# Altium schematic sheet Schematic_photodiode_1.SchDoc
size A3; SheetNumber: 1; SheetTotal: 1
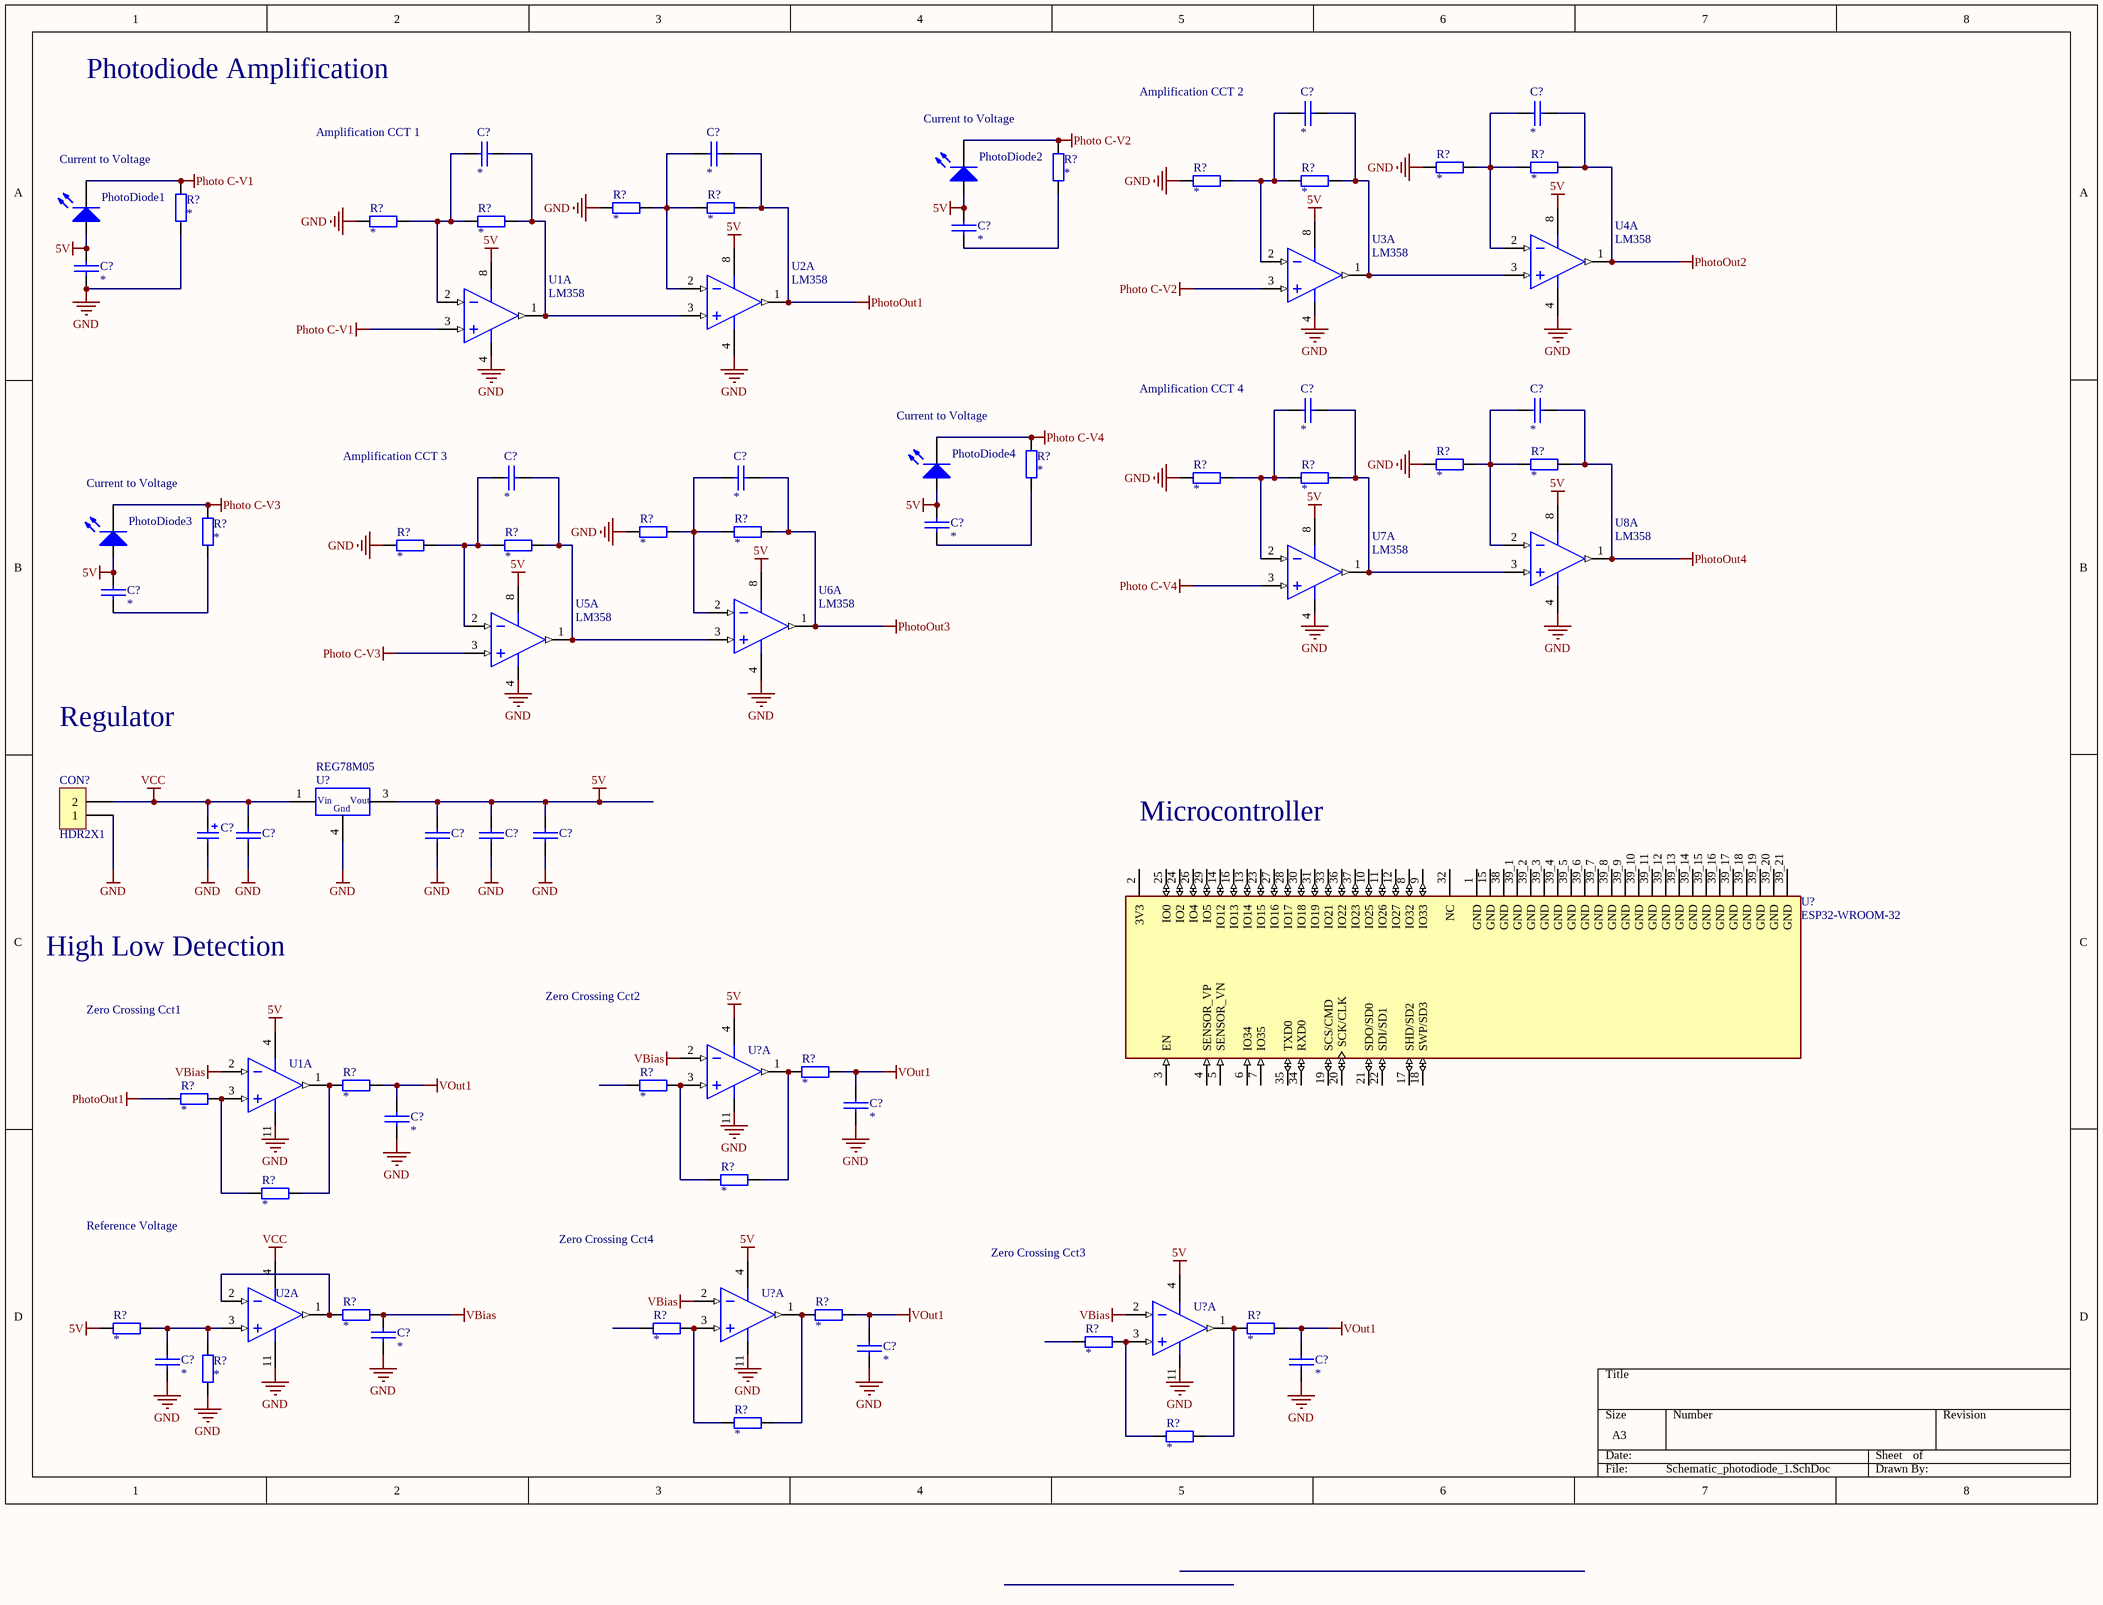
[diagram p0: Schematic_photodiode_1.SchDoc]

## Parts
(Parts that share a designator on the sheet are numbered #1, #2 ... from top to bottom, then left to right.)
C?#1  *  [FILM CAP-0.2]
C?#2  *  [FILM CAP-0.2]
C?#3  *  [FILM CAP-0.2]
C?#4  *  [FILM CAP-0.2]
C?#5  *  [CCAP-5P0]
C?#6  *  [CCAP-5P0]
C?#7  *  [FILM CAP-0.2]
C?#8  *  [FILM CAP-0.2]
C?#9  *  [FILM CAP-0.2]
C?#10  *  [FILM CAP-0.2]
C?#11  *  [CCAP-5P0]
C?#12  *  [CCAP-5P0]
C?#13  ECAP  [CR05]  (value not drawn)
C?#14  CCAP_TH_5P0  [CCAP_5P0]  (value not drawn)
C?#15  CCAP_TH_5P0  [CCAP_5P0]  (value not drawn)
C?#16  CCAP_TH_5P0  [CCAP_5P0]  (value not drawn)
C?#17  CCAP_TH_5P0  [CCAP_5P0]  (value not drawn)
C?#18  *  [CCAP-5P0]
C?#19  *  [CCAP-5P0]
C?#20  *  [CCAP-5P0]
C?#21  *  [CCAP-5P0]
C?#22  *  [CCAP-5P0]
C?#23  *  [CCAP-5P0]
CON?  HDR2X1  [HDR2X1_2P54]
PhotoDiode1  (no value)  [LED]
PhotoDiode2  (no value)  [LED]
PhotoDiode3  (no value)  [LED]
PhotoDiode4  (no value)  [LED]
R?#1  *  [AXIAL-0.4]
R?#2  *  [AXIAL-0.4]
R?#3  *  [AXIAL-0.4]
R?#4  *  [AXIAL-0.4]
R?#5  *  [AXIAL-0.4]
R?#6  *  [AXIAL-0.4]
R?#7  *  [AXIAL-0.4]
R?#8  *  [AXIAL-0.4]
R?#9  *  [AXIAL-0.4]
R?#10  *  [AXIAL-0.4]
R?#11  *  [AXIAL-0.4]
R?#12  *  [AXIAL-0.4]
R?#13  *  [AXIAL-0.4]
R?#14  *  [AXIAL-0.4]
R?#15  *  [AXIAL-0.4]
R?#16  *  [AXIAL-0.4]
R?#17  *  [AXIAL-0.4]
R?#18  *  [AXIAL-0.4]
R?#19  *  [AXIAL-0.4]
R?#20  *  [AXIAL-0.4]
R?#21  *  [AXIAL-0.4]
R?#22  *  [AXIAL-0.4]
R?#23  *  [AXIAL-0.4]
R?#24  *  [AXIAL-0.4]
R?#25  *  [AXIAL-0.4]
R?#26  *  [AXIAL-0.4]
R?#27  *  [AXIAL-0.4]
R?#28  *  [AXIAL-0.4]
R?#29  *  [AXIAL-0.4]
R?#30  *  [AXIAL-0.4]
R?#31  *  [AXIAL-0.4]
R?#32  *  [AXIAL-0.4]
R?#33  *  [AXIAL-0.4]
R?#34  *  [AXIAL-0.4]
R?#35  *  [AXIAL-0.4]
U1#1  LM358  [DIP-8]  (part A of 2)
U1#2  LM324  [DIP-14]  (value not drawn)  (part A of 4)
U2#1  LM358  [DIP-8]  (part A of 2)
U2#2  LM324  [DIP-14]  (value not drawn)  (part A of 4)
U3  LM358  [DIP-8]  (part A of 2)
U4  LM358  [DIP-8]  (part A of 2)
U5  LM358  [DIP-8]  (part A of 2)
U6  LM358  [DIP-8]  (part A of 2)
U7  LM358  [DIP-8]  (part A of 2)
U8  LM358  [DIP-8]  (part A of 2)
U?#1  REG78M05  [TO220_Reg]
U?#2  ESP32-WROOM-32  [MODULE_ESP32-WROOM-32]
U?#3  LM324  [DIP-14]  (value not drawn)  (part A of 4)
U?#4  LM324  [DIP-14]  (value not drawn)  (part A of 4)
U?#5  LM324  [DIP-14]  (value not drawn)  (part A of 4)

## Nets
5V: C?#5.1 C?#6.1 C?#11.1 C?#12.1 C?#15.2 C?#16.2 C?#17.2 PhotoDiode1.1(A) PhotoDiode2.1(A) PhotoDiode3.1(A) PhotoDiode4.1(A) R?#29.1 U1#1.8(VDD) U1#2.4(VDD) U2#1.8(VDD) U3.8(VDD) U4.8(VDD) U5.8(VDD) U6.8(VDD) U7.8(VDD) U8.8(VDD) U?#1.3(Vout) U?#3.4(VDD) U?#4.4(VDD) U?#5.4(VDD)
GND: C?#6.2 C?#13.2 C?#14.1 C?#15.1 C?#16.1 C?#17.1 C?#18.2 C?#19.2 C?#20.2 C?#21.2 C?#22.2 C?#23.2 CON?.1 R?#2.1 R?#4.1 R?#6.1 R?#7.1 R?#9.1 R?#12.1 R?#14.1 R?#17.1 R?#19.1 R?#33.1 U2#1.4(VSS) U2#2.11(VSS) U4.4(VSS) U6.4(VSS) U8.4(VSS) U?#1.4(Gnd)
Photo C-V1: PhotoDiode1.2(K) R?#6.2 U1#1.3(VINA+)
Photo C-V2: PhotoDiode2.2(K) R?#1.2 U3.3(VINA+)
Photo C-V3: PhotoDiode3.2(K) R?#16.2 U5.3(VINA+)
Photo C-V4: PhotoDiode4.2(K) R?#11.2 U7.3(VINA+)
PhotoOut1: C?#4.2 R?#8.2 R?#24.1 U2#1.1(VOUTA)
PhotoOut2: C?#2.2 R?#3.2 U4.1(VOUTA)
PhotoOut3: C?#10.2 R?#18.2 U6.1(VOUTA)
PhotoOut4: C?#8.2 R?#13.2 U8.1(VOUTA)
VBias: C?#20.1 R?#27.2 U1#2.2(VINA-) U?#3.2(VINA-) U?#4.2(VINA-) U?#5.2(VINA-)
VCC: C?#13.1 C?#14.2 CON?.2 U2#2.4(VDD) U?#1.1(Vin)
VOut1: C?#18.1 C?#19.1 C?#21.1 C?#23.1 R?#21.2 R?#22.2 R?#28.2 R?#31.2
NetC?#1_1: C?#1.1 R?#4.2 R?#5.1 U3.2(VINA-)
NetC?#1_2: C?#1.2 R?#5.2 U3.1(VOUTA) U4.3(VINA+)
NetC?#2_1: C?#2.1 R?#2.2 R?#3.1 U4.2(VINA-)
NetC?#3_1: C?#3.1 R?#9.2 R?#10.1 U1#1.2(VINA-)
NetC?#3_2: C?#3.2 R?#10.2 U1#1.1(VOUTA) U2#1.3(VINA+)
NetC?#4_1: C?#4.1 R?#7.2 R?#8.1 U2#1.2(VINA-)
NetC?#5_2: C?#5.2 R?#1.1
NetC?#7_1: C?#7.1 R?#14.2 R?#15.1 U7.2(VINA-)
NetC?#7_2: C?#7.2 R?#15.2 U7.1(VOUTA) U8.3(VINA+)
NetC?#8_1: C?#8.1 R?#12.2 R?#13.1 U8.2(VINA-)
NetC?#9_1: C?#9.1 R?#19.2 R?#20.1 U5.2(VINA-)
NetC?#9_2: C?#9.2 R?#20.2 U5.1(VOUTA) U6.3(VINA+)
NetC?#10_1: C?#10.1 R?#17.2 R?#18.1 U6.2(VINA-)
NetC?#11_2: C?#11.2 R?#11.1
NetC?#12_2: C?#12.2 R?#16.1
NetC?#22_1: C?#22.1 R?#29.2 R?#33.2 U2#2.3(VINA+)
NetR?#21_1: R?#21.1 R?#25.2 U?#3.1(VOUTA)
NetR?#22_1: R?#22.1 R?#26.2 U1#2.1(VOUTA)
NetR?#23_2: R?#23.2 R?#25.1 U?#3.3(VINA+)
NetR?#24_2: R?#24.2 R?#26.1 U1#2.3(VINA+)
NetR?#27_1: R?#27.1 U2#2.1(VOUTA) U2#2.2(VINA-)
NetR?#28_1: R?#28.1 R?#34.2 U?#4.1(VOUTA)
NetR?#30_2: R?#30.2 R?#34.1 U?#4.3(VINA+)
NetR?#31_1: R?#31.1 R?#35.2 U?#5.1(VOUTA)
NetR?#32_2: R?#32.2 R?#35.1 U?#5.3(VINA+)

Not connected (* = marked no-connect by the designer): R?#23 1; R?#30 1; R?#32 1; U1#1 4(VSS); U1#2 11(VSS); U3 4(VSS); U5 4(VSS); U7 4(VSS); U?#2 1(GND) 2(3V3) 3(EN) 4(SENSOR_VP) 5(SENSOR_VN) 6(IO34) 7(IO35) 8(IO32) 9(IO33) 10(IO25) 11(IO26) 12(IO27) 13(IO14) 14(IO12) 15(GND) 16(IO13) 17(SHD/SD2) 18(SWP/SD3) 19(SCS/CMD) 20(SCK/CLK) 21(SDO/SD0) 22(SDI/SD1) 23(IO15) 24(IO2) 25(IO0) 26(IO4) 27(IO16) 28(IO17) 29(IO5) 30(IO18) 31(IO19) 32(NC) 33(IO21) 34(RXD0) 35(TXD0) 36(IO22) 37(IO23) 38(GND) 39_1(GND) 39_2(GND) 39_3(GND) 39_4(GND) 39_5(GND) 39_6(GND) 39_7(GND) 39_8(GND) 39_9(GND) 39_10(GND) 39_11(GND) 39_12(GND) 39_13(GND) 39_14(GND) 39_15(GND) 39_16(GND) 39_17(GND) 39_18(GND) 39_19(GND) 39_20(GND) 39_21(GND); U?#3 11(VSS); U?#4 11(VSS); U?#5 11(VSS)

## Notes on the sheet
- Photodiode Amplification
- (near C?#1) Amplification CCT 2
- Current to Voltage
- (near C?#3) Amplification CCT 1
- (near C?#7) Amplification CCT 4
- (near C?#9) Amplification CCT 3
- Regulator
- Microcontroller
- High Low Detection
- Zero Crossing Cct1
- Zero Crossing Cct2
- Reference Voltage
- Zero Crossing Cct4
- Zero Crossing Cct3
- Labels drawn without touching a wire or pin: GND

## Library data of the parts
C?#1-C?#4 C?#7-C?#10 = FilmCap_TH_5P08: Throughhole film capacitor with 5.08mm pitch; Value: *
C?#5 C?#6 C?#11 C?#12 C?#18-C?#23 = CerCap_TH_5P0: TH ceramic capacitor with 5mm pitch; Value: *
C?#13 = CMP-003-000000-2: Source: CommonSymbols_V1.SchLib; Design Item ID: ECAP
C?#14-C?#17 = CMP-001-00023-1: TH ceramic cap with 5mm pitch; Design Item ID: CCAP_5P0
CON? = CMP-004-000000-7: Header 2X1; Design Item ID: HDR2X1; Source: CommonSymbols_V1.SchLib
PhotoDiode1-PhotoDiode4 = LED_TH_2P54: Typical throughole GaAs LED with 2.54mm pitch; Manufacturer: Generic Components; Class I: Optoelectronic; Value: Green; Published: 8-Jun-2000; Revision: July-2002: Re-released for DXP Platform.; Publisher: Altium Limited; Class II: LED
R?#1-R?#35 = Res_TH_0AX4: Through hole resistor; Published: 8-Jun-2000; LatestRevisionDate: 17-Jul-2002; LatestRevisionNote: Re-released for DXP Platform.; PackageReference: AXIAL-0.4; Publisher: Altium Limited; Value: *; ComponentLink1Description: http://www.royalohm.com/pdf/product2017/PrecisionMetalMF.pdf
U1#1 U2#1 U3-U8 = LM358_TH_DIP8: IC OPAMP DIP; ComponentLink1URL: http://www.ti.com/lit/ds/symlink/tlc080a.pdf; ComponentLink1Description: http://www.ti.com/lit/ds/symlink/tlc080a.pdf; Supplier 1: Avnet; Supplier Part Number 1: LM358N
U1#2 U2#2 U?#3-U?#5 = LM324N_TH_DIP16: IC OPAMP GP 14DIP; Manufacturer: ON Semiconductor; Manufacturer Part Number: LM324N; Amplifier Type: General Purpose; Current - Supply: 1mA; Voltage - Supply, Single/Dual (±): 3 V ~ 32 V, ±1.5 V ~ 16 V; Supplier 1: Digi-Key; RoHS: RoHS Compliant; Category: Integrated Circuits (ICs); Stock 1: 2900; Pricing 1: 1=0.9, 10=0.775, 100=0.5789, 500=0.45482, 1000=0.35145 (NZD); Packaging: Tube; Part Status: Active; Output Type: -; Slew Rate: -; Operating Temperature: 0°C ~ 70°C; Mounting Type: Through Hole; Package / Case: 14-DIP (0.300", 7.62mm); Supplier Device Package: 14-DIP; Base Part Number: LM324; ComponentLink1URL: https://www.fairchildsemi.com/datasheets/LM/LM2902.pdf; ComponentLink1Description: https://www.fairchildsemi.com/datasheets/LM/LM2902.pdf; Supplier Part Number 1: LM324NFS-ND
U?#1 = CMP-011-000018-2: 78M Series Linear Regulators; Source: CommonSymbols_V1.SchLib; Design Item ID: REG78MXX
U?#2 = ESP32-WROOM-32: Bluetooth, WiFi 802.11b/g/n, Bluetooth v4.2 +EDR, Class 1, 2 and 3 Transceiver Module 2.4GHz ~ 2.5GHz Antenna Not Included, U.FL Surface Mount; MF: Espressif Systems; Price: None; Availability: In Stock; MP: ESP32-WROOM-32; Package: Module Espressif Systems; SnapEDA_Link: https://www.snapeda.com/parts/ESP32-WROOM-32/Espressif+Systems/view-part/?ref=snap; Check_prices: https://www.snapeda.com/parts/ESP32-WROOM-32/Espressif+Systems/view-part/?ref=eda; Value: *; Purchase-URL: https://pricing.snapeda.com/search/part/ESP32-WROOM-32/?ref=eda